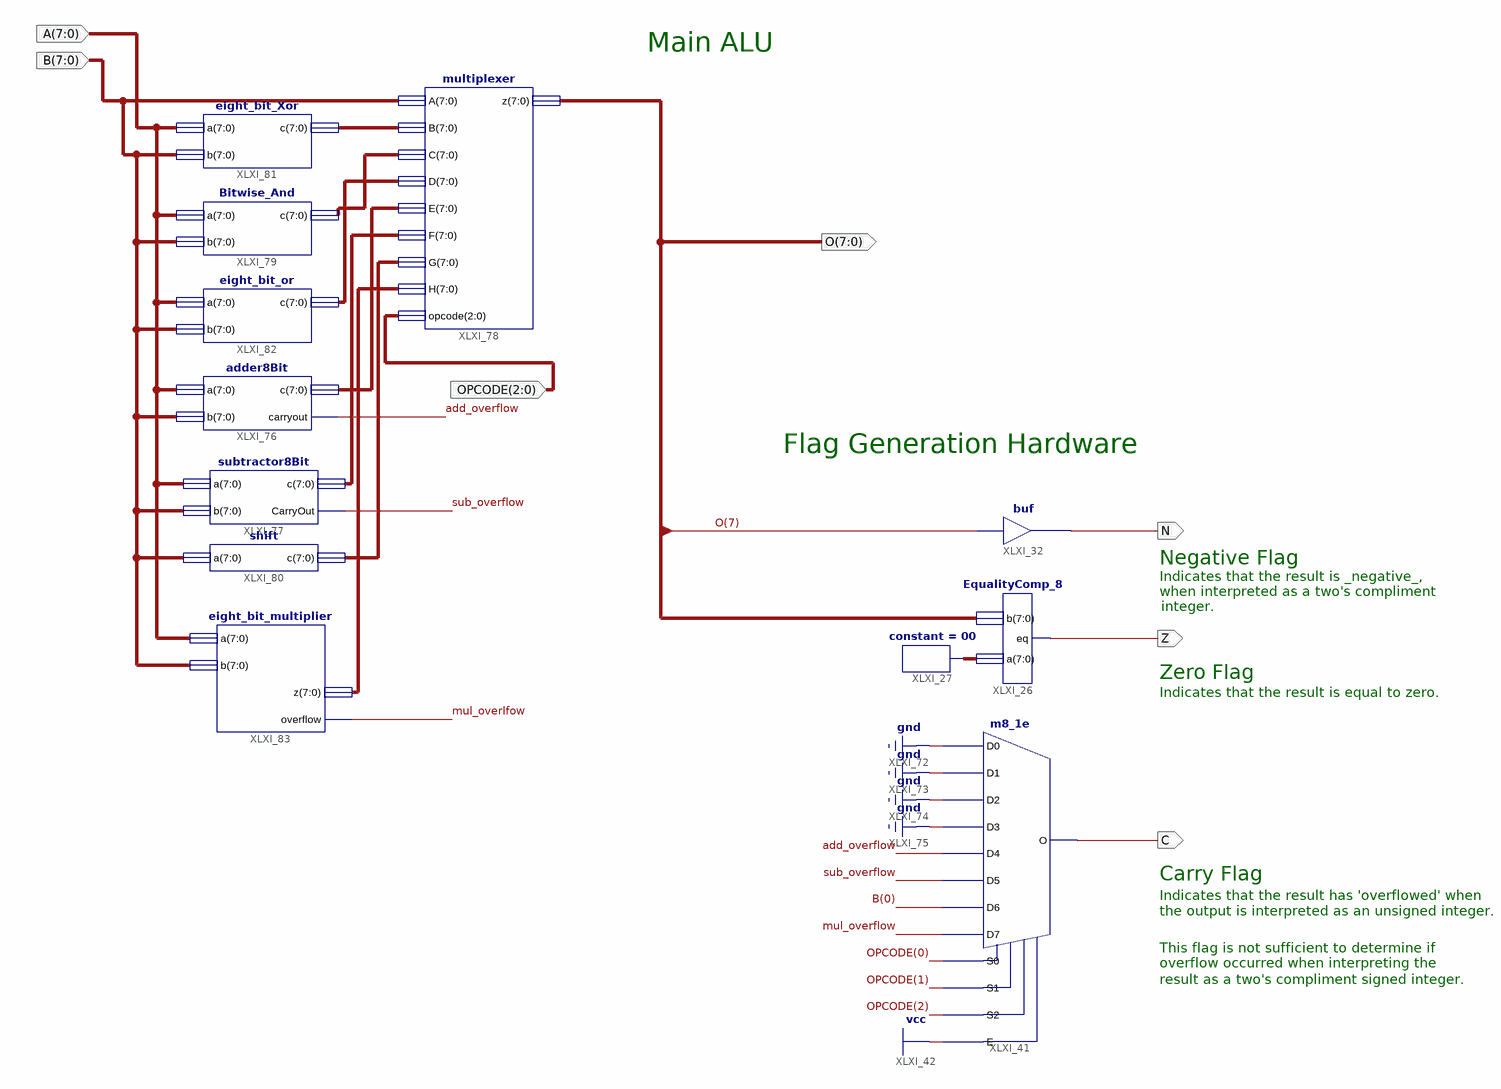
[diagram p0: schematic sheet 1]
// Xilinx ISE schematic ALU.sch (spartan6) as structural Verilog: 12 symbols, 7 ports
module ALU (
  input  [7:0] B,
  input  [7:0] A,
  input  [2:0] OPCODE,
  output [7:0] O,
  output C,
  output Z,
  output N
);

  wire add_overflow, mul_overflow, mul_overlfow, sub_overflow;
  wire [7:0] XLXN_55, XLXN_165, XLXN_179, XLXN_180, XLXN_181, XLXN_182, XLXN_184, XLXN_187;

  EqualityComp_8 XLXI_26 (.a(XLXN_55), .b(O), .eq(Z));
  constant #(.CValue("00")) XLXI_27 (.O(XLXN_55));
  m8_1e XLXI_41 (
    .D0(1'b0), .D1(1'b0), .D2(1'b0), .D3(1'b0), .D4(add_overflow), .D5(sub_overflow), .D6(B[0]),
    .D7(mul_overflow), .E(1'b1), .S0(OPCODE[0]), .S1(OPCODE[1]), .S2(OPCODE[2]), .O(C));
  buf XLXI_32 (N, O[7]);
  adder8Bit XLXI_76 (.a(A), .b(B), .c(XLXN_181), .carryout(add_overflow));
  subtractor8Bit XLXI_77 (.a(A), .b(B), .c(XLXN_182), .CarryOut(sub_overflow));
  multiplexer XLXI_78 (
    .A(B), .B(XLXN_165), .C(XLXN_179), .D(XLXN_180), .E(XLXN_181), .F(XLXN_182), .G(XLXN_184), .H(XLXN_187),
    .opcode(OPCODE), .z(O));
  Bitwise_And XLXI_79 (.a(A), .b(B), .c(XLXN_179));
  shift XLXI_80 (.a(B), .c(XLXN_184));
  eight_bit_Xor XLXI_81 (.a(A), .b(B), .c(XLXN_165));
  eight_bit_or XLXI_82 (.a(A), .b(B), .c(XLXN_180));
  eight_bit_multiplier XLXI_83 (.b(B), .a(A), .z(XLXN_187), .overflow(mul_overlfow));

  // Notes on the sheet:
  //   Main ALU
  //   Flag Generation Hardware
  //   Negative Flag
  //   Indicates that the result is _negative_,
  //   when interpreted as a two's compliment
  //   integer.
  //   Zero Flag
  //   Indicates that the result is equal to zero.
  //   Carry Flag
  //   Indicates that the result has 'overflowed' when
  //   the output is interpreted as an unsigned integer.
  //   This flag is not sufficient to determine if
  //   overflow occurred when interpreting the
  //   result as a two's compliment signed integer.
endmodule
